# Altium schematic sheet levelshifter_page.SchDoc
size A
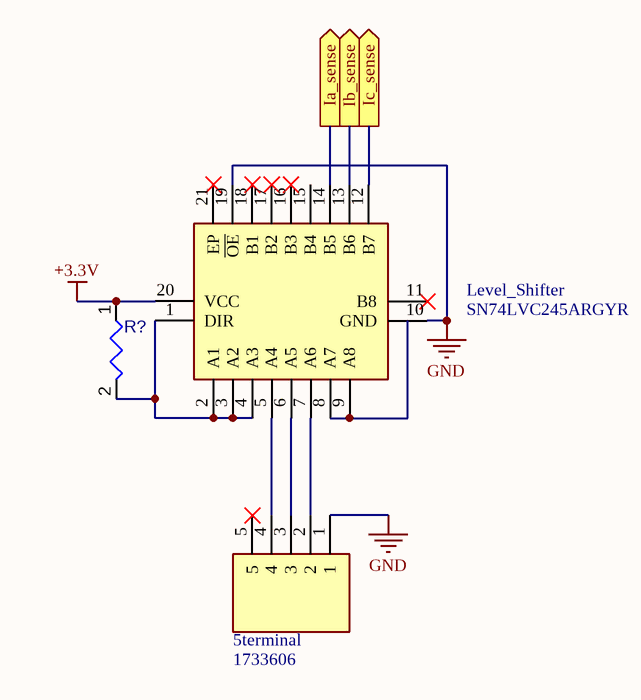
[diagram p0: levelshifter_page.SchDoc]

## Parts
5terminal  1733606  [1733606]
Level_Shifter  SN74LVC245ARGYR  [SN74LVC541ARGYR]
R?  Resistor 25K5 +/-1 % 0402 63 mW  [RESC0402(1005)_L]  (value not drawn)

## Ports
Ia_sense (out), Ib_sense (out), Ic_sense (out)

## Nets
+3.3V: Level_Shifter.20(VCC) R?.1
GND: 5terminal.1 Level_Shifter.10(GND) Level_Shifter.19(~{OE})
Ia_sense: Level_Shifter.14(B5) ; port Ia_sense
Ib_sense: Level_Shifter.13(B6) ; port Ib_sense
Ic_sense: Level_Shifter.12(B7) ; port Ic_sense
Net5terminal_2: 5terminal.2 Level_Shifter.7(A6)
Net5terminal_3: 5terminal.3 Level_Shifter.6(A5)
Net5terminal_4: 5terminal.4 Level_Shifter.5(A4)
NetLevel_Shifter_1: Level_Shifter.1(DIR) Level_Shifter.2(A1) Level_Shifter.3(A2) Level_Shifter.4(A3) R?.2
NetLevel_Shifter_8: Level_Shifter.8(A7) Level_Shifter.9(A8)

Not connected (* = marked no-connect by the designer): 5terminal 5*; Level_Shifter 11(B8)* 15(B4) 16(B3)* 17(B2)* 18(B1)* 21(EP)*

## Library data of the parts
5terminal = 1733606: Connector; Manufacturer_Name: Phoenix Contact; Datasheet Link: https://www.phoenixcontact.com/online/portal/us?uri=pxc-oc-itemdetail:pid=1733606&library=usen&tab=1; Height: 15.45mm; Manufacturer_Part_Number: 1733606; Mouser Part Number: 651-1733606; Mouser Price/Stock: https://www.mouser.co.uk/ProductDetail/Phoenix-Contact/1733606/?qs=coeDwHeOZKnxpzvXWWKBZQ%3D%3D; Arrow Part Number: 1733606; Arrow Price/Stock: https://www.arrow.com/en/products/1733606/phoenix-contact
Level_Shifter = SN74LVC245ARGYR: Integrated Circuit; Manufacturer_Name: Texas Instruments; Datasheet Link: http://www.ti.com/lit/gpn/sn74lvc245a; Height: 1mm; Manufacturer_Part_Number: SN74LVC245ARGYR; Mouser Part Number: 595-SN74LVC245ARGYR; Mouser Price/Stock: https://www.mouser.com/Search/Refine.aspx?Keyword=595-SN74LVC245ARGYR; Arrow Part Number: SN74LVC245ARGYR; Arrow Price/Stock: https://www.arrow.com/en/products/sn74lvc245argyr/texas-instruments
R? = CMP-009-00171-3: Chip Resistor, 25,5 kOhms, +/-1 %, 63 mW, -55 to 155 degC, 0402; Tolerance: 1%; Power: 63mW; Case/Package: 0402; Min Operating Temperature: -55°C; Max Operating Temperature: 155°C; Pins: 2